# Altium schematic sheet input19-21.SchDoc
size 420 x 297 mm; Обозначение документа: QFP input19-21; Номер листа: 6; Общее количество листов: 9
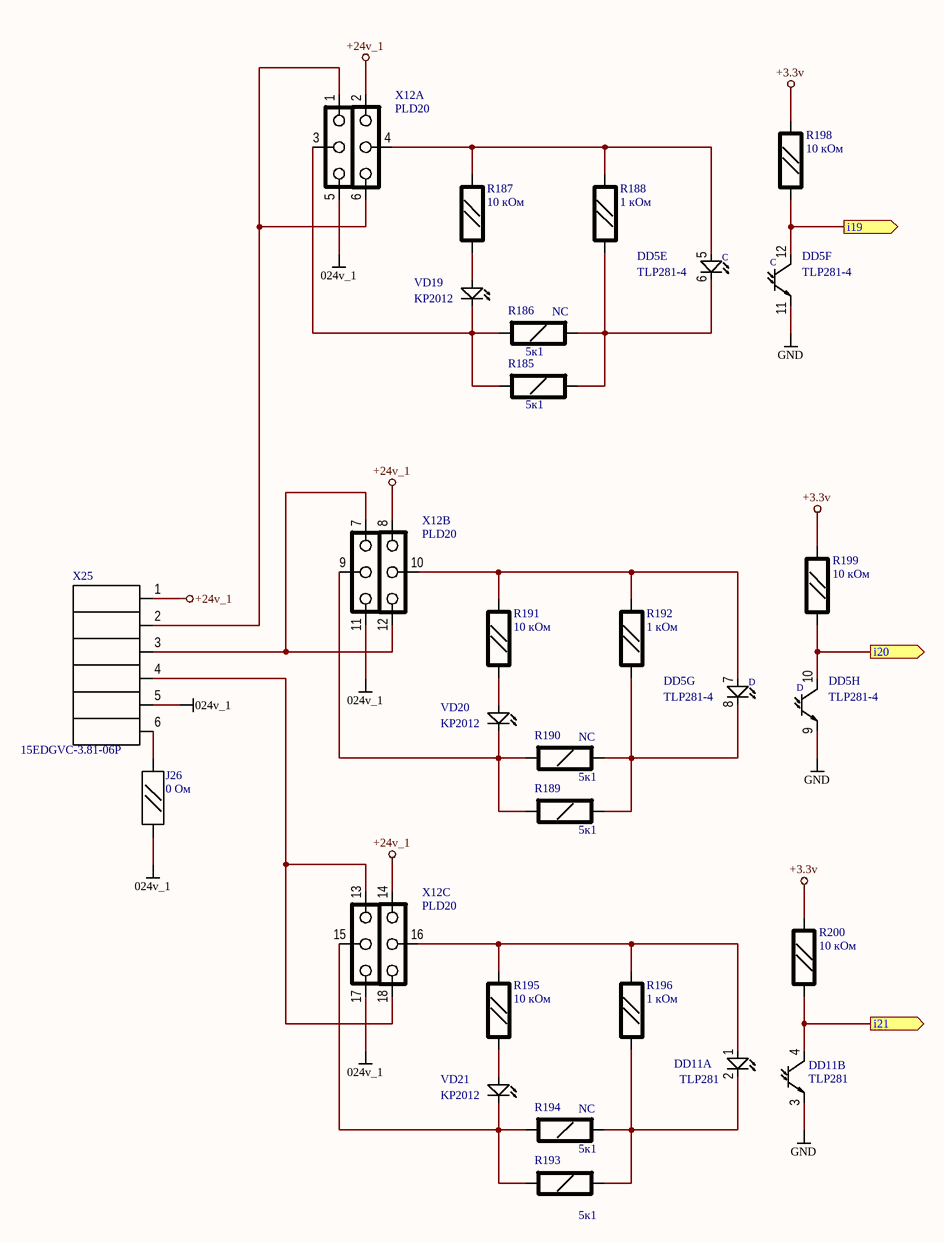
[diagram p0: input19-21.SchDoc]

## Parts
DD5  TLP281-4  [SO16]  (parts E,F,G,H of 8)
DD11  TLP281  [SOIC4]  (parts A,B of 2)
J26  0 Ом  [SMD0805RES]
R185  5к1  [RES1206]
R186  5к1  SolderOpton: NC  [RES1206]
R187  10 кОм  [SMD0805RES]
R188  1 кОм  [SMD0805RES]
R189  5к1  [RES1206]
R190  5к1  SolderOpton: NC  [RES1206]
R191  10 кОм  [SMD0805RES]
R192  1 кОм  [SMD0805RES]
R193  5к1  [RES1206]
R194  5к1  SolderOpton: NC  [RES1206]
R195  10 кОм  [SMD0805RES]
R196  1 кОм  [SMD0805RES]
R198  10 кОм  [SMD0805RES]
R199  10 кОм  [SMD0805RES]
R200  10 кОм  [SMD0805RES]
VD19  KP2012  [SMD0805DIO_C]
VD20  KP2012  [SMD0805DIO_C]
VD21  KP2012  [SMD0805DIO_C]
X12  PLD20  [pld2x10_1.27]  (parts A,B,C of 7)
X25  15EDGVC-3.81-06P  [15EDGVC_081_6]

## Ports
i19 (out), i20 (out), i21 (out)

## Nets
024v_1: J26.2 X12.5 X12.11 X12.17 X25.5
+3.3v: R198.2 R199.2 R200.2
+24v_1: X12.2 X12.8 X12.14 X25.1
GND: DD5.9(Emitter_D) DD5.11(Emitter_C) DD11.3(Emitter)
i19: DD5.12(Collector_C) R198.1 ; port i19
i20: DD5.10(Collector_D) R199.1 ; port i20
i21: DD11.4(Collector) R200.1 ; port i21
NetDD5_5: DD5.5(Anode_C) R187.1 R188.1 X12.4
NetDD5_6: DD5.6(Cathode) R185.2 R186.2 R188.2
NetDD5_7: DD5.7(Anode_D) R191.1 R192.1 X12.10
NetDD5_8: DD5.8(Cathode_D) R189.2 R190.2 R192.2
NetDD11_1: DD11.1(Anode) R195.1 R196.1 X12.16
NetDD11_2: DD11.2(Cathode) R193.2 R194.2 R196.2
NetJ26_1: J26.1 X25.6
NetR185_1: R185.1 R186.1 VD19.1(Cathode) X12.3
NetR187_2: R187.2 VD19.2(Anode)
NetR189_1: R189.1 R190.1 VD20.1(Cathode) X12.9
NetR191_2: R191.2 VD20.2(Anode)
NetR193_1: R193.1 R194.1 VD21.1(Cathode) X12.15
NetR195_2: R195.2 VD21.2(Anode)
NetX12_1: X12.1 X12.6 X25.2
NetX12_7: X12.7 X12.12 X25.3
NetX12_13: X12.13 X12.18 X25.4

## Notes on the sheet
- Подп. и дата
- Инв. № дубл.
- Взам. инв. №
- Инв. № подл.
- Изм.
- Лист
- № докум.
- Подп.
- Дата
- Копировал
- Формат А3
- (in symbol TLP281-4, part E) C
- (in symbol TLP281-4, part F) C
- (in symbol TLP281-4, part G) D
- (in symbol TLP281-4, part H) D

## Library data of the parts
DD5 = TLP281-4: 4х канальная транзисторная оптопара; Vendor: Tosba; Voltage: 80V; SolderOptoin: Norm; Value: TLP281-4; Price: 250
DD11 = TLP281: Оптопара транзисторная; Vendor: Tosba; Voltage: 80V; SolderOption: Norm; Value: TLP281; Price: 150
J26 = JR0805: SMD 0805 перемычка; SolderOption: Norm; Price: 2; Vendor: *; Value: 0 Ом
R185 R189 R193 = R1206: Чип резистор 1206; Vendor: Generic; Tolerance: 5%; SolderOpton: Norm; Price: 2; Value: 5к1
R186 R190 R194 = R1206: Чип резистор 1206; Vendor: Generic; Tolerance: 5%; Price: 2; Value: 5к1
R187 R188 R191 R192 R195 R196 R198-R200 = R0805: Чип резистор 0805; Vendor: Generic; Tolerance: 5%; SolderOpton: Norm; Price: 2
  R187 R191 R195 R198-R200: Value: 10 кОм
  R188 R192 R196: Value: 1 кОм
VD19-VD21 = KP2012_C: Чип светодиод 0805; Vendor: KB; Color: Green; SolderOpton: Norm; Price: 20; Value: KP2012
X12 = PLD20: Вилка  PLD 20/1.27; Vendor: Confly; SolderOption: Norm; Price: 10; Value: PLD20
X25 = 15EDGVC-3.81-06P: Вилка  6/3.81; Vendor: Degson; Current: 8А; Voltage: 2кВ; Price: 50; Value: 15EDGVC-3.81-06P